# EAGLE design octanis_eps (EAGLE 7.1.0)
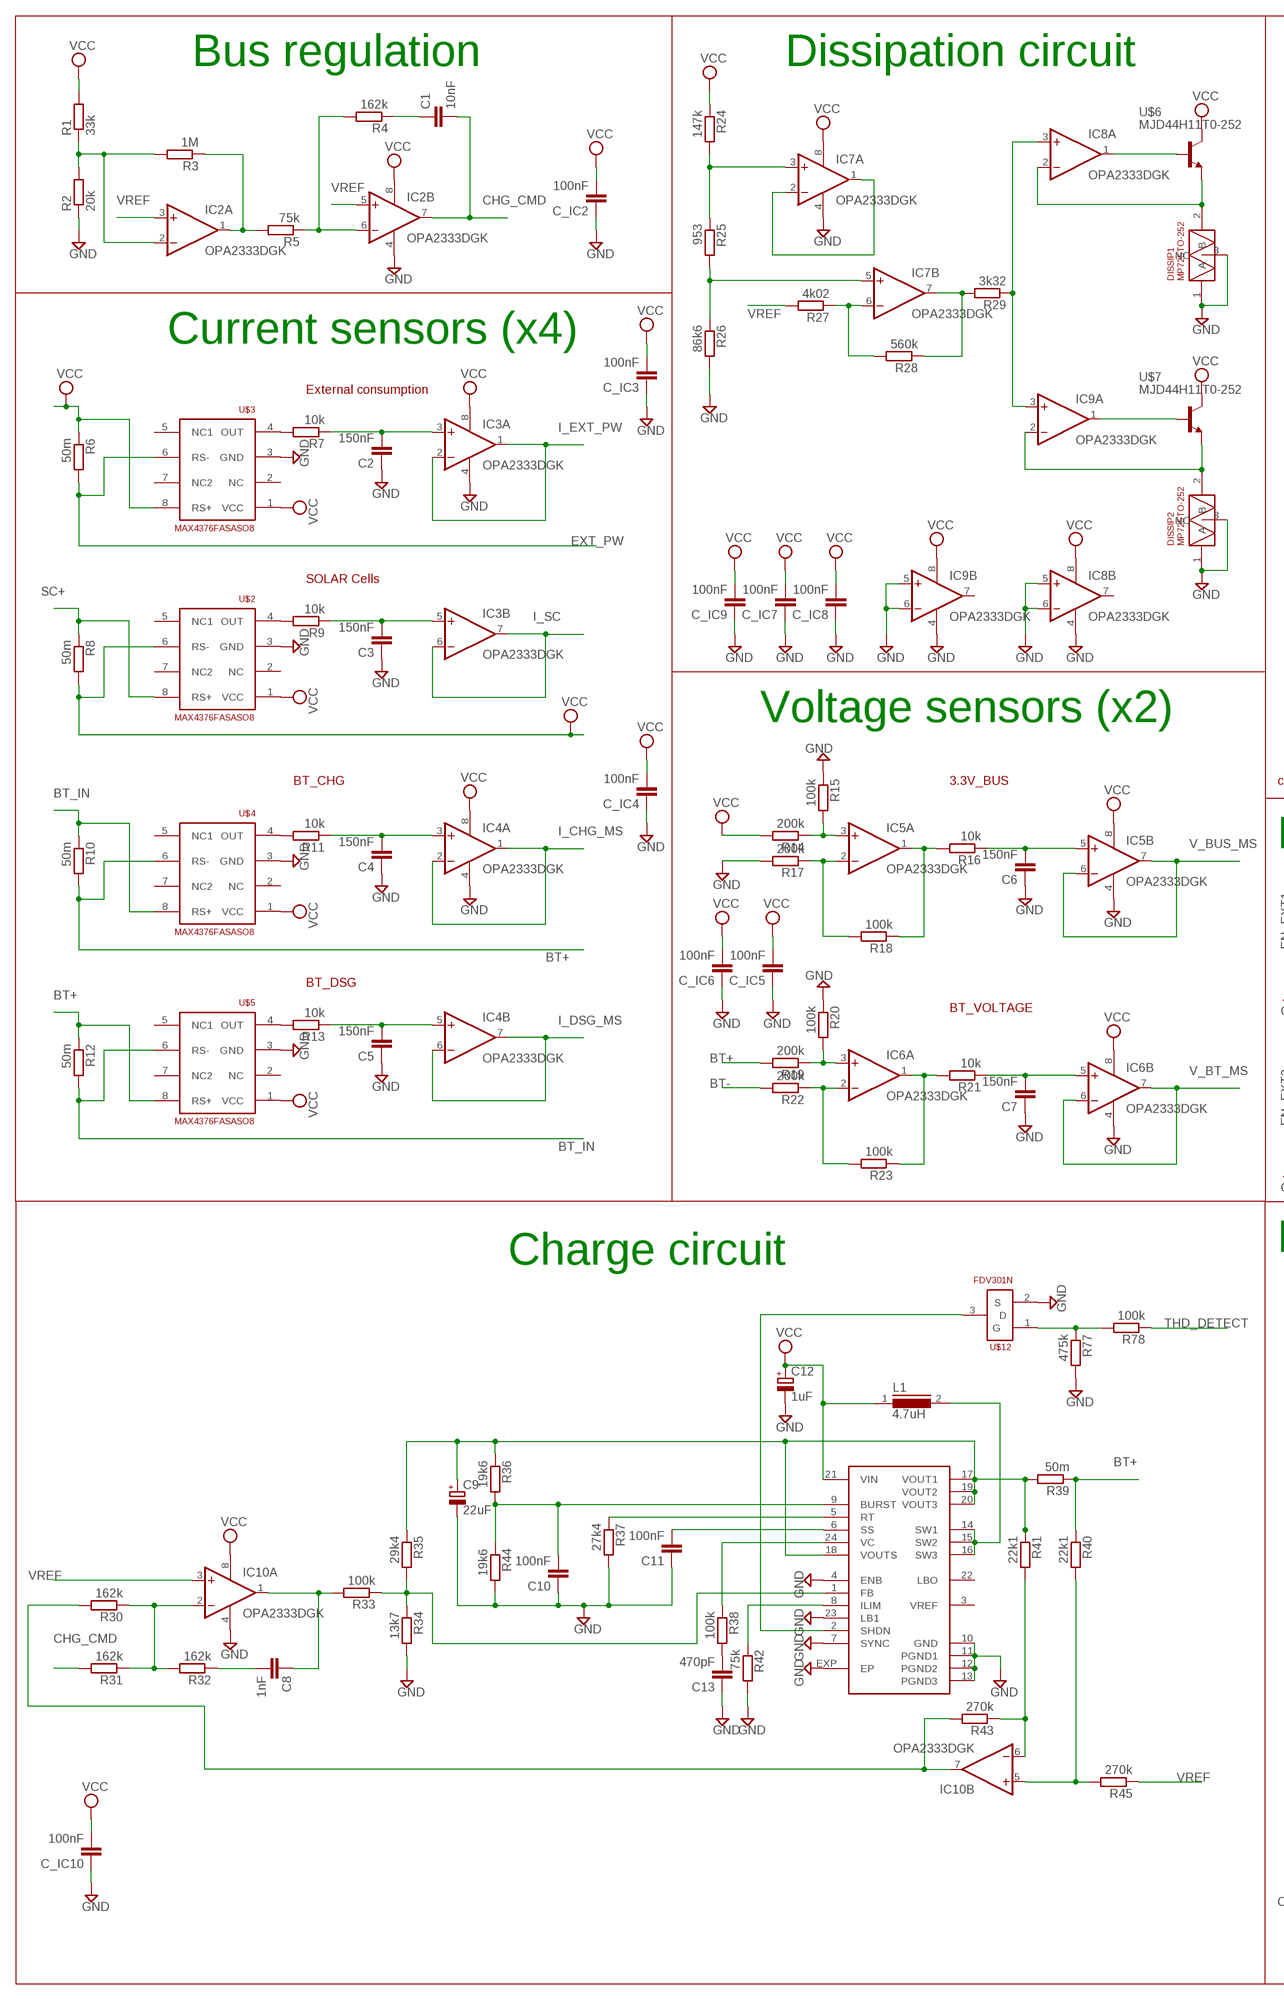
[diagram p0: schematic, sheet 1, part 1 of 2]
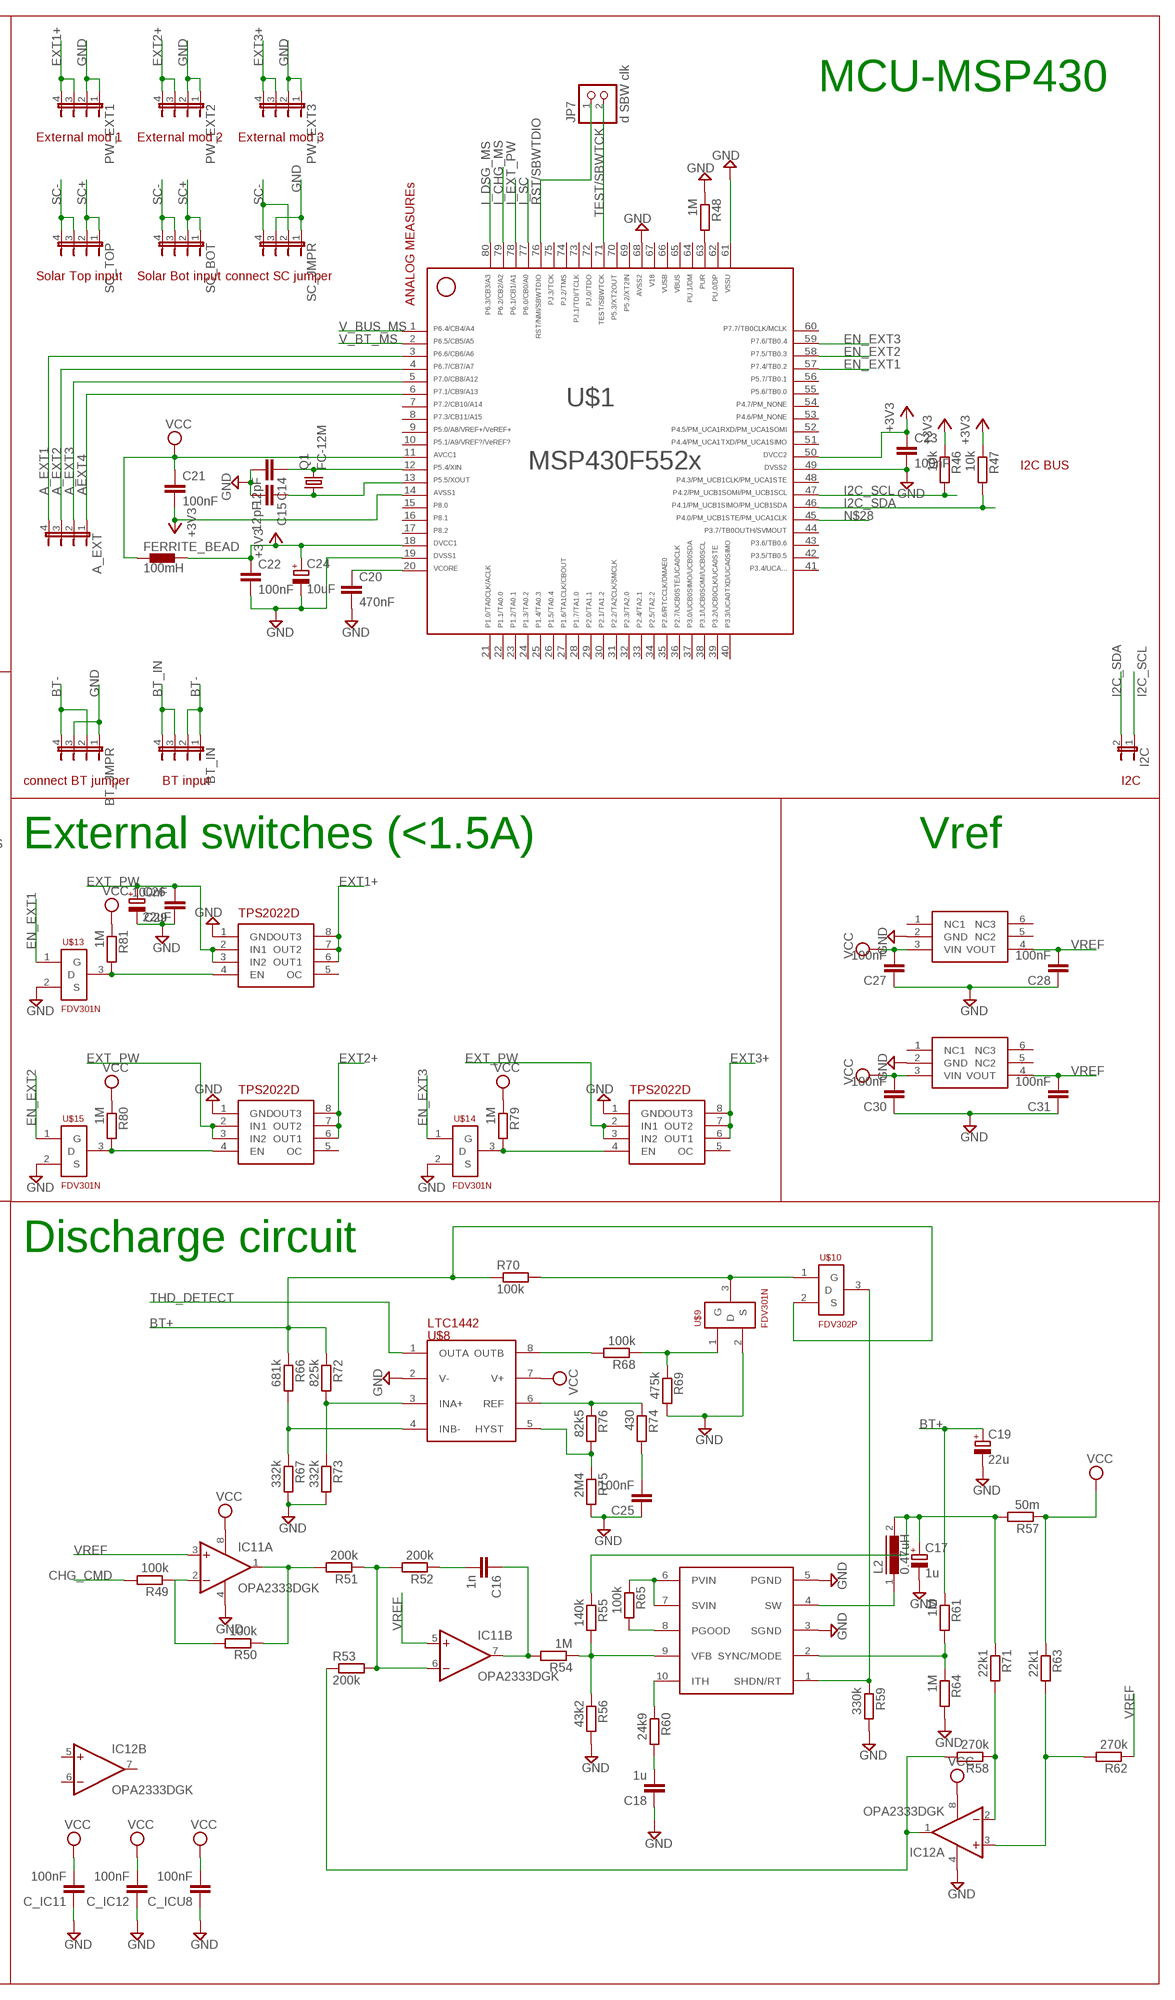
[diagram p1: schematic, sheet 1, part 2 of 2]

## Parts
A_EXT  JP4E  [JP4]
BT_IN  JP4E  [JP4]
BT_JMPR  JP4E  [JP4]
C1  10nF  C-EUC0603  [C0603]
C2  150nF  C-EUC0603  [C0603]
C3  150nF  C-EUC0603  [C0603]
C4  150nF  C-EUC0603  [C0603]
C5  150nF  C-EUC0603  [C0603]
C6  150nF  C-EUC0603  [C0603]
C7  150nF  C-EUC0603  [C0603]
C8  1nF  C-EUC0603  [C0603]
C9  22uF  CPOL-EUA/3216-18R  [A/3216-18R]
C10  100nF  C-EUC0603  [C0603]
C11  100nF  C-EUC0603  [C0603]
C12  1uF  CPOL-EUA/3216-18R  [A/3216-18R]
C13  470pF  C-EUC0603  [C0603]
C14  12pF  C-EUC0603  [C0603]
C15  12pF  C-EUC0603  [C0603]
C16  1n  C-EUC0603  [C0603]
C17  1u  CPOL-EUA/3216-18R  [A/3216-18R]
C18  1u  C-EUC0603  [C0603]
C19  22u  CPOL-EUA/3216-18R  [A/3216-18R]
C20  470nF  C-EUC0603  [C0603]
C21  100nF  C-EUC0603  [C0603]
C22  100nF  C-EUC0603  [C0603]
C23  100nF  C-EUC0603  [C0603]
C24  10uF  CPOL-EUA/3216-18R  [A/3216-18R]
C25  100nF  C-EUC0603  [C0603]
C26  22uF  CPOL-EUA/3216-18R  [A/3216-18R]
C27  100nF  C-EUC0603  [C0603]
C28  100nF  C-EUC0603  [C0603]
C29  100nF  C-EUC0603  [C0603]
C30  100nF  C-EUC0603  [C0603]
C31  100nF  C-EUC0603  [C0603]
C_IC2  100nF  C-EUC0603  [C0603]
C_IC3  100nF  C-EUC0603  [C0603]
C_IC4  100nF  C-EUC0603  [C0603]
C_IC5  100nF  C-EUC0603  [C0603]
C_IC6  100nF  C-EUC0603  [C0603]
C_IC7  100nF  C-EUC0603  [C0603]
C_IC8  100nF  C-EUC0603  [C0603]
C_IC9  100nF  C-EUC0603  [C0603]
C_IC10  100nF  C-EUC0603  [C0603]
C_IC11  100nF  C-EUC0603  [C0603]
C_IC12  100nF  C-EUC0603  [C0603]
C_ICU8  100nF  C-EUC0603  [C0603]
DISSIP1  MP725TO-252  [TO252]
DISSIP2  MP725TO-252  [TO252]
FERRITE_BEAD  100mH  BLM15HD601SN1  [0402]
I2C  JP1E  [JP1]
IC2  OPA2333DGK  [MSOP08]
IC3  OPA2333DGK  [MSOP08]
IC4  OPA2333DGK  [MSOP08]
IC5  OPA2333DGK  [MSOP08]
IC6  OPA2333DGK  [MSOP08]
IC7  OPA2333DGK  [MSOP08]
IC8  OPA2333DGK  [MSOP08]
IC9  OPA2333DGK  [MSOP08]
IC10  OPA2333DGK  [MSOP08]
IC11  OPA2333DGK  [MSOP08]
IC12  OPA2333DGK  [MSOP08]
JP7  d SBW clk  PINHD-1X2  [1X02]
L1  4.7uH  DR73  [DR73]
L2  0.47uH  DR73  [DR73]
LTC3411  LT3411  [MSOP10]
PW_EXT1  JP4E  [JP4]
PW_EXT2  JP4E  [JP4]
PW_EXT3  JP4E  [JP4]
Q1  FC-12M  [FC-12M]
R1  33k  R-EU_R0603  [R0603]
R2  20k  R-EU_R0603  [R0603]
R3  1M  R-EU_R0603  [R0603]
R4  162k  R-EU_R0603  [R0603]
R5  75k  R-EU_R0603  [R0603]
R6  50m  R-EU_R1206  [R1206]
R7  10k  R-EU_R0603  [R0603]
R8  50m  R-EU_R1206  [R1206]
R9  10k  R-EU_R0603  [R0603]
R10  50m  R-EU_R1206  [R1206]
R11  10k  R-EU_R0603  [R0603]
R12  50m  R-EU_R1206  [R1206]
R13  10k  R-EU_R0603  [R0603]
R14  200k  R-EU_R0603  [R0603]
R15  100k  R-EU_R0603  [R0603]
R16  10k  R-EU_R0603  [R0603]
R17  200k  R-EU_R0603  [R0603]
R18  100k  R-EU_R0603  [R0603]
R19  200k  R-EU_R0603  [R0603]
R20  100k  R-EU_R0603  [R0603]
R21  10k  R-EU_R0603  [R0603]
R22  200k  R-EU_R0603  [R0603]
R23  100k  R-EU_R0603  [R0603]
R24  147k  R-EU_R0603  [R0603]
R25  953  R-EU_R0603  [R0603]
R26  86k6  R-EU_R0603  [R0603]
R27  4k02  R-EU_R0603  [R0603]
R28  560k  R-EU_R0603  [R0603]
R29  3k32  R-EU_R0603  [R0603]
R30  162k  R-EU_R0603  [R0603]
R31  162k  R-EU_R0603  [R0603]
R32  162k  R-EU_R0603  [R0603]
R33  100k  R-EU_R0603  [R0603]
R34  13k7  R-EU_R0603  [R0603]
R35  29k4  R-EU_R0603  [R0603]
R36  19k6  R-EU_R0603  [R0603]
R37  27k4  R-EU_R0603  [R0603]
R38  100k  R-EU_R0603  [R0603]
R39  50m  R-EU_R1206  [R1206]
R40  22k1  R-EU_R0603  [R0603]
R41  22k1  R-EU_R0603  [R0603]
R42  75k  R-EU_R0603  [R0603]
R43  270k  R-EU_R0603  [R0603]
R44  19k6  R-EU_R0603  [R0603]
R45  270k  R-EU_R0603  [R0603]
R46  10k  R-EU_R0603  [R0603]
R47  10k  R-EU_R0603  [R0603]
R48  1M  R-EU_R0603  [R0603]
R49  100k  R-EU_R0603  [R0603]
R50  100k  R-EU_R0603  [R0603]
R51  200k  R-EU_R0603  [R0603]
R52  200k  R-EU_R0603  [R0603]
R53  200k  R-EU_R0603  [R0603]
R54  1M  R-EU_R0603  [R0603]
R55  140k  R-EU_R0603  [R0603]
R56  43k2  R-EU_R0603  [R0603]
R57  50m  R-EU_R1206  [R1206]
R58  270k  R-EU_R0603  [R0603]
R59  330k  R-EU_R0603  [R0603]
R60  24k9  R-EU_R0603  [R0603]
R61  1M  R-EU_R0603  [R0603]
R62  270k  R-EU_R0603  [R0603]
R63  22k1  R-EU_R0603  [R0603]
R64  1M  R-EU_R0603  [R0603]
R65  100k  R-EU_R0603  [R0603]
R66  681k  R-EU_R0603  [R0603]
R67  332k  R-EU_R0603  [R0603]
R68  100k  R-EU_R0603  [R0603]
R69  475k  R-EU_R0603  [R0603]
R70  100k  R-EU_R0603  [R0603]
R71  22k1  R-EU_R0603  [R0603]
R72  825k  R-EU_R0603  [R0603]
R73  332k  R-EU_R0603  [R0603]
R74  430  R-EU_R0603  [R0603]
R75  2M4  R-EU_R0603  [R0603]
R76  82k5  R-EU_R0603  [R0603]
R77  475k  R-EU_R0603  [R0603]
R78  100k  R-EU_R0603  [R0603]
R79  1M  R-EU_R0603  [R0603]
R80  1M  R-EU_R0603  [R0603]
R81  1M  R-EU_R0603  [R0603]
SC_BOT  JP4E  [JP4]
SC_JMPR  JP4E  [JP4]
SC_TOP  JP4E  [JP4]
U$1  F552X---PN80  [PN80]
U$2  MAX4376FASASO8  [SO8]
U$3  MAX4376FASASO8  [SO8]
U$4  MAX4376FASASO8  [SO8]
U$5  MAX4376FASASO8  [SO8]
U$6  MJD44H11T0-252  [TO252]
U$7  MJD44H11T0-252  [TO252]
U$8  LTC1442  [SO8]
U$9  FDV301N  [SOT23]
U$10  FDV302P  [SOT23]
U$11  LTC3421  [QFN24]
U$12  FDV301N  [SOT23]
U$13  FDV301N  [SOT23]
U$14  FDV301N  [SOT23]
U$15  FDV301N  [SOT23]
U$16  TPS2022D  [SO8]
U$17  TPS2022D  [SO8]
U$18  TPS2022D  [SO8]
U$19  ADR127B  [TSOT23-6]
U$20  ADR127B  [TSOT23-6]

## Nets
+3V3: C21.2 C22.1 C23.1 C24.+ FERRITE_BEAD.2 R46.1 R47.1 U$1.14 U$1.18 U$1.50
A_EXT1: A_EXT.4 U$1.3
A_EXT2: A_EXT.3 U$1.4
A_EXT3: A_EXT.2 U$1.5
AEXT4: A_EXT.1 U$1.6
BT+: C19.+ R10.2 R12.1 R19.2 R39.1 R40.1 R61.1 R66.1 R70.1 R72.1 U$4.6(RS-) U$5.8(RS+) U$10.2(S)
BT-: BT_IN.1 BT_IN.2 BT_JMPR.2 BT_JMPR.4 R22.2
BT_IN: BT_IN.3 BT_IN.4 R10.1 R12.2 U$4.8(RS+) U$5.6(RS-)
CHG_CMD: C1.2 IC2.7(B:OUT) R31.2 R49.2
EN_EXT1: U$1.57 U$13.1(G)
EN_EXT2: U$1.58 U$15.1(G)
EN_EXT3: U$1.59 U$14.1(G)
EXT1+: PW_EXT1.3 PW_EXT1.4 U$16.6(OUT1) U$16.7(OUT2) U$16.8(OUT3)
EXT2+: PW_EXT2.3 PW_EXT2.4 U$17.6(OUT1) U$17.7(OUT2) U$17.8(OUT3)
EXT3+: PW_EXT3.3 PW_EXT3.4 U$18.6(OUT1) U$18.7(OUT2) U$18.8(OUT3)
EXT_PW: C26.+ C29.2 R6.2 U$3.6(RS-) U$16.2(IN1) U$16.3(IN2) U$17.2(IN1) U$17.3(IN2) U$18.2(IN1) U$18.3(IN2)
GND: BT_JMPR.1 BT_JMPR.3 C2.1 C3.1 C4.1 C5.1 C6.1 C7.1 C9.- C10.1 C11.1 C12.- C13.1 C14.2 C15.2 C17.- C18.1 C19.- C20.2 C22.2 C23.2 C24.- C25.1 C26.- C27.1 C28.1 C29.1 C30.1 C31.1 C_IC2.1 C_IC3.1 C_IC4.1 C_IC5.1 C_IC6.1 C_IC7.1 C_IC8.1 C_IC9.1 C_IC10.1 C_IC11.1 C_IC12.1 C_ICU8.1 DISSIP1.1(A) DISSIP1.3(NC) DISSIP2.1(A) DISSIP2.3(NC) IC2.4(P:V-) IC3.4(P:V-) IC4.4(P:V-) IC5.4(P:V-) IC6.4(P:V-) IC7.4(P:V-) IC8.4(P:V-) IC8.5(B:+IN) IC8.6(B:-IN) IC9.4(P:V-) IC9.5(B:+IN) IC9.6(B:-IN) IC10.4(P:V-) IC11.4(P:V-) IC12.4(P:V-) LTC3411.3(SGND) LTC3411.5(PGND) PW_EXT1.1 PW_EXT1.2 PW_EXT2.1 PW_EXT2.2 PW_EXT3.1 PW_EXT3.2 R2.1 R15.1 R17.2 R20.1 R26.2 R34.2 R37.2 R42.2 R44.2 R48.1 R56.2 R59.2 R64.2 R67.2 R69.2 R73.2 R75.2 R77.2 SC_JMPR.1 SC_JMPR.3 U$1.19 U$1.49 U$1.61 U$1.68 U$2.3(GND) U$3.3(GND) U$4.3(GND) U$5.3(GND) U$8.2(V-) U$9.2(S) U$11.4(ENB) U$11.7(SYNC) U$11.10(GND) U$11.11(PGND1) U$11.12(PGND2) U$11.13(PGND3) U$11.23(LB1) U$11.EXP(EP) U$12.2(S) U$13.2(S) U$14.2(S) U$15.2(S) U$16.1(GND) U$17.1(GND) U$18.1(GND) U$19.2(GND) U$20.2(GND)
I2C_SCL: I2C.1 R46.2 U$1.47
I2C_SDA: I2C.2 R47.2 U$1.46
I_CHG_MS: IC4.1(A:OUT) IC4.2(A:-IN) U$1.79
I_DSG_MS: IC4.6(B:-IN) IC4.7(B:OUT) U$1.80
I_EXT_PW: IC3.1(A:OUT) IC3.2(A:-IN) U$1.78
I_SC: IC3.6(B:-IN) IC3.7(B:OUT) U$1.77
N$1: IC2.2(A:-IN) R1.1 R2.2 R3.2
N$2: IC2.1(A:OUT) R3.1 R5.2
N$3: C1.1 R4.1
N$4: IC2.6(B:-IN) R4.2 R5.1
N$5: C4.2 IC4.3(A:+IN) R11.1
N$6: C2.2 IC3.3(A:+IN) R7.1
N$7: C3.2 IC3.5(B:+IN) R9.1
N$8: C5.2 IC4.5(B:+IN) R13.1
N$9: C7.2 IC6.5(B:+IN) R21.1
N$10: IC6.1(A:OUT) R21.2 R23.1
N$11: C6.2 IC5.5(B:+IN) R16.1
N$12: IC5.1(A:OUT) R16.2 R18.1
N$13: IC5.2(A:-IN) R17.1 R18.2
N$14: IC5.3(A:+IN) R14.1 R15.2
N$15: IC6.2(A:-IN) R22.1 R23.2
N$16: IC6.3(A:+IN) R19.1 R20.2
N$17: IC7.1(A:OUT) IC7.2(A:-IN)
N$18: IC7.3(A:+IN) R24.2 R25.1
N$19: IC7.5(B:+IN) R25.2 R26.1
N$20: IC7.6(B:-IN) R27.1 R28.2
N$21: IC7.7(B:OUT) R28.1 R29.2
N$22: IC8.3(A:+IN) IC9.3(A:+IN) R29.1
N$23: IC10.2(A:-IN) R30.1 R31.1 R32.2
N$24: C8.2 R32.1
N$25: C8.1 IC10.1(A:OUT) R33.2
N$26: R33.1 R34.1 R35.2 U$11.1(FB)
N$27: R48.2 U$1.63
N$28: U$1.45
N$29: R42.1 U$11.8(ILIM)
N$30: C10.2 R36.2 R44.1 U$11.9(BURST)
N$31: C13.2 R38.2
N$32: R37.1 U$11.5(RT)
N$33: C11.2 U$11.6(SS)
N$34: R80.2 U$15.3(D) U$17.4(EN)
N$35: C18.2 R60.2
N$36: R38.1 U$11.24(VC)
N$37: U$11.2(SHDN) U$12.3(D)
N$38: IC10.5(B:+IN) R40.2 R45.2
N$39: IC10.6(B:-IN) R41.2 R43.1
N$40: R9.2 U$2.4(OUT)
N$41: R11.2 U$4.4(OUT)
N$42: R7.2 U$3.4(OUT)
N$43: R13.2 U$5.4(OUT)
N$44: IC8.1(A:OUT) U$6.1(B)
N$45: IC9.1(A:OUT) U$7.1(B)
N$46: DISSIP2.2(B) IC9.2(A:-IN) U$7.3(E)
N$47: DISSIP1.2(B) IC8.2(A:-IN) U$6.3(E)
N$48: C14.1 Q1.2 U$1.12
N$49: C20.1 U$1.20
N$50: C15.1 Q1.1 U$1.13
N$51: C16.1 IC11.7(B:OUT) R54.2
N$52: IC11.2(A:-IN) R49.1 R50.2
N$53: IC11.1(A:OUT) R50.1 R51.2
N$54: IC11.6(B:-IN) R51.1 R52.2 R53.2
N$55: C16.2 R52.1
N$56: IC12.1(A:OUT) R53.1 R58.2
N$57: LTC3411.9(VFB) R54.1 R55.2 R56.1
N$58: C17.+ L2.2 R55.1 R57.2 R71.1
N$59: LTC3411.10(ITH) R60.1
N$60: LTC3411.2(SYNC/MODE) R61.2 R64.1
N$61: IC12.2(A:-IN) R58.1 R71.2
N$63: IC12.3(A:+IN) R62.2 R63.2
N$64: LTC3411.8(PGOOD) R65.2
N$65: LTC3411.6(PVIN) LTC3411.7(SVIN) R65.1
N$66: LTC3411.1(SHDN/RT) R59.1 U$10.3(D)
N$67: R66.2 R67.1 U$8.4(INB-)
N$68: R68.2 U$8.8(OUTB)
N$69: R68.1 R69.1 U$9.1(G)
N$70: R72.2 R73.1 U$8.3(INA+)
N$71: R70.2 U$9.3(D) U$10.1(G)
N$72: R74.1 R76.1 U$8.6(REF)
N$73: R75.1 R76.2 U$8.5(HYST)
N$74: C25.2 R74.2
N$75: C9.+ R35.1 R36.1 R39.2 R41.1 U$11.17(VOUT1) U$11.18(VOUTS) U$11.19(VOUT2) U$11.20(VOUT3)
N$76: R77.1 R78.2 U$12.1(G)
N$77: L2.1 LTC3411.4(SW)
N$78: L1.2 U$11.14(SW1) U$11.15(SW2) U$11.16(SW3)
N$79: R81.2 U$13.3(D) U$16.4(EN)
N$80: R79.2 U$14.3(D) U$18.4(EN)
RST/SBWTDIO: JP7.1 U$1.76
SC+: R8.1 SC_BOT.1 SC_BOT.2 SC_TOP.1 SC_TOP.2 U$2.8(RS+)
SC-: SC_BOT.3 SC_BOT.4 SC_JMPR.2 SC_JMPR.4 SC_TOP.3 SC_TOP.4
TEST/SBWTCK: JP7.2 U$1.71
THD_DETECT: R78.1 U$8.1(OUTA)
UUU: IC10.7(B:OUT) R30.2 R43.2
V_BT_MS: IC6.6(B:-IN) IC6.7(B:OUT) U$1.2
V_BUS_MS: IC5.6(B:-IN) IC5.7(B:OUT) U$1.1
VCC: C12.+ C21.1 C27.2 C30.2 C_IC2.2 C_IC3.2 C_IC4.2 C_IC5.2 C_IC6.2 C_IC7.2 C_IC8.2 C_IC9.2 C_IC10.2 C_IC11.2 C_IC12.2 C_ICU8.2 FERRITE_BEAD.1 IC2.8(P:V+) IC3.8(P:V+) IC4.8(P:V+) IC5.8(P:V+) IC6.8(P:V+) IC7.8(P:V+) IC8.8(P:V+) IC9.8(P:V+) IC10.8(P:V+) IC11.8(P:V+) IC12.8(P:V+) L1.1 R1.2 R6.1 R8.2 R14.2 R24.1 R57.1 R63.1 R79.1 R80.1 R81.1 U$1.11 U$2.1(VCC) U$2.6(RS-) U$3.1(VCC) U$3.8(RS+) U$4.1(VCC) U$5.1(VCC) U$6.2(C) U$7.2(C) U$8.7(V+) U$11.21(VIN) U$19.3(VIN) U$20.3(VIN)
VREF: C28.2 C31.2 IC2.3(A:+IN) IC2.5(B:+IN) IC10.3(A:+IN) IC11.3(A:+IN) IC11.5(B:+IN) R27.2 R45.1 R62.1 U$19.4(VOUT) U$20.4(VOUT)
Unconnected: IC8.7(B:OUT) IC9.7(B:OUT) IC12.5(B:+IN) IC12.6(B:-IN) IC12.7(B:OUT) U$1.7 U$1.8 U$1.9 U$1.10 U$1.15 U$1.16 U$1.17 U$1.21 U$1.22 U$1.23 U$1.24 U$1.25 U$1.26 U$1.27 U$1.28 U$1.29 U$1.30 U$1.31 U$1.32 U$1.33 U$1.34 U$1.35 U$1.36 U$1.37 U$1.38 U$1.39 U$1.40 U$1.41 U$1.42 U$1.43 U$1.44 U$1.48 U$1.51 U$1.52 U$1.53 U$1.54 U$1.55 U$1.56 U$1.60 U$1.62 U$1.64 U$1.69 U$1.70 U$1.72 U$1.73 U$1.74 U$1.75 U$2.2(NC) U$2.5(NC1) U$2.7(NC2) U$3.2(NC) U$3.5(NC1) U$3.7(NC2) U$4.2(NC) U$4.5(NC1) U$4.7(NC2) U$5.2(NC) U$5.5(NC1) U$5.7(NC2) U$11.3(VREF) U$11.22(LBO) U$16.5(OC) U$17.5(OC) U$18.5(OC) U$19.1(NC1) U$19.5(NC2) U$19.6(NC3) U$20.1(NC1) U$20.5(NC2) U$20.6(NC3)

## Notes on the sheet
- Bus regulation | Dissipation circuit
- MCU-MSP430
- External mod 1 | External mod 2 | External mod 3
- Solar Top input | Solar Bot input | connect SC jumper
- ANALOG MEASUREs
- Current sensors (x4)
- External consumption
- I2C BUS
- SOLAR Cells
- Voltage sensors (x2)
- BT_CHG | 3.3V_BUS | connect BT jumper | BT input | I2C
- External switches (<1.5A) | Vref
- BT_DSG
- BT_VOLTAGE
- Charge circuit | Discharge circuit

## Power pins joined to a net without a drawn wire
65: U$1.65
66: U$1.66
67: U$1.67

## Library data of the parts
A_EXT BT_IN BT_JMPR PW_EXT1-PW_EXT3 SC_BOT SC_JMPR SC_TOP = jumper:JP4E: JUMPER
C1-C8 C10 C11 C13-C16 C18 C20-C23 C25 C27-C31 C_IC2-C_IC12 C_ICU8 = rcl:C-EU: CAPACITOR, European symbol
C9 C12 C17 C19 C24 C26 = rcl:CPOL-EU: POLARIZED CAPACITOR, European symbol
DISSIP1 DISSIP2 = Octanis1_EPS:MP725
FERRITE_BEAD = inductors:BLM15H: EMIFIL (R) Chip Ferrite Bead for GHz Noise Source: http://www.murata.com/ Ferrite Bead BLM15H.pdf
I2C = jumper:JP1E: JUMPER
IC2-IC12 = linear:OPA2333: DUAL 1.8V, microPOWER CMOS OPERATIONAL AMPLIFIERS Zerø-Drift Series Source: Texas Instruments (Burr-Brown) .. U11 opa333 Operational Amp.pdf
JP7 = pinhead:PINHD-1X2: PIN HEADER
L1 L2 = inductors:DR73: High Power Density, High Efficiency, Shielded Inductors Source: coiltronics_dr_series.pdf
LTC3411 = Octanis1_EPS:LT3411: LINEAR TECHNOLOGY - LTC3411AEMS#PBF - CONV. BUCK SYNCH 1.25A 4MHZ 10MSOP
Q1 = crystal:FC-12M: kHz RANGE CRYSTAL UNIT LOW PROFILE SMD Source: Epson Toyocom FC-12M.pdf
R1-R81 = rcl:R-EU_: RESISTOR, European symbol
U$1 = TI_MSP430_v16:F552X---PN80: ***MSP430F552X***PN80 http://www.ti.com/lit/gpn/msp430f5529 Rev1.0 06/2010 For F552X where X is 1,5,7,9
U$2-U$5 = Octanis1_EPS:MAX4376FASA: MAX4376/MAX4377/ MAX4378 Single/Dual/Quad, High-Side Current-Sense Amplifiers with Internal Gain
U$6 U$7 = Octanis1_EPS:MJD44H11: MJD44H11, MJD45H11 Complementary power transistors
U$8 = Octanis1_EPS:LTC1442: Ultralow Power Single/Dual Comparator with Reference
U$9 U$12-U$15 = Octanis1_EPS:FDV301N: FDV301N Digital FET ,N-Channel
U$10 = Octanis1_EPS:FDV302P: FAIRCHILD SEMICONDUCTOR - FDV302P - TRANSISTOR MOSFET NUMERIQ P SOT-23
U$11 = Octanis1_EPS:LTC3421: 3A, 3MHz Micropower Synchronous Boost Converter with Output Disconnect
U$16-U$18 = Octanis1_EPS:TPS2022D: TEXAS INSTRUMENTS - TPS2022D - IC, 1.5A PWR DIST SWITCH 8SOIC
U$19 U$20 = Octanis1_EPS:ADR127B: ANALOG DEVICES - ADR127BUJZ-REEL7 - VOLTAGE REFERENCE, SERIES, 3.3V, TSOT-6

## Board
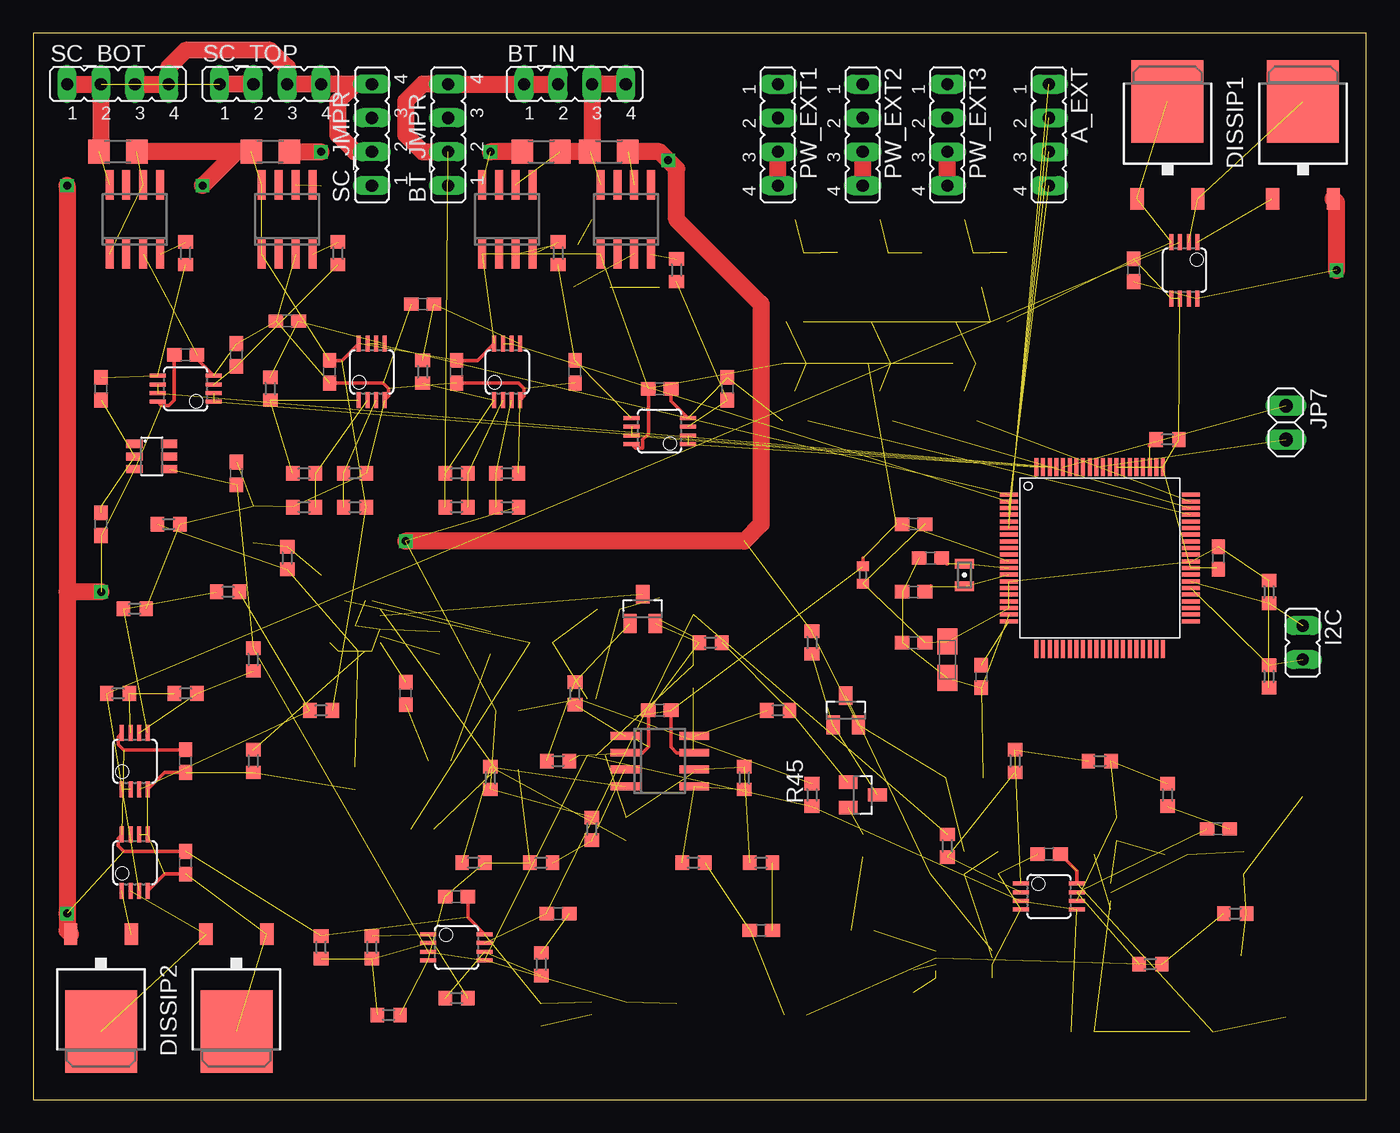
[diagram p2: board, top side]
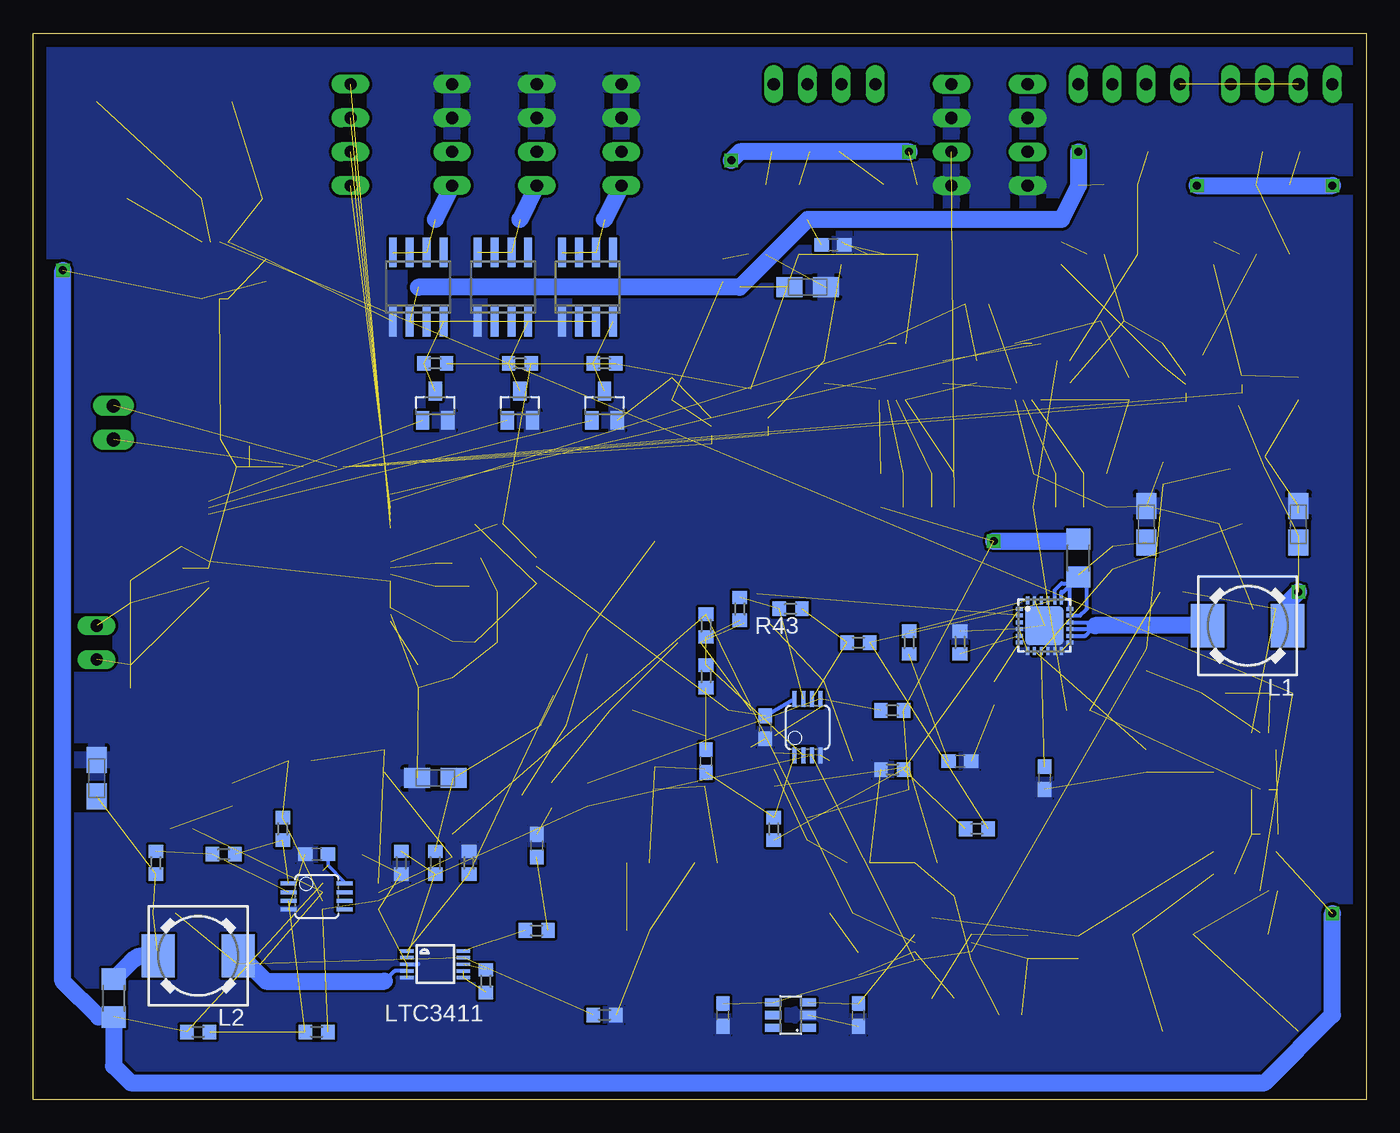
[diagram p3: board, bottom side, seen from below]

Size 100 x 80 mm. Coordinates in mm from the lower left corner, seen from the top.
Outline: 0,0 100,0 100,80 0,80 0,0
Copper layers (1*16): Top 0.035mm / dielectric 1.5mm / Bottom 0.035mm
Design rules "default": minimum track width 10mil, minimum drill 24mil, track to track 8mil, track to pad 8mil, pad to pad 8mil, via to via 8mil, smd to smd 8mil, copper to edge 40mil, drill to drill 8mil, minimum pad ring 10mil, minimum via ring 8mil, stop-mask expansion 4mil, vias tented up to drill 0mil, thermal gap 10mil

### Footprints (pad centres in the part's own frame; a part is rotated, then mirrored left to right if it is on the bottom)
JP4 = drill 0.914 long: 1 -3.81,0; 2 -1.27,0; 3 1.27,0; 4 3.81,0
C0603 = smd 1.1 x 1: 1 -0.85,0; 2 0.85,0
A/3216-18R = smd 1.95 x 1.5: + 1.375,0; - -1.375,0
TO252 = smd 1 x 1.6: 1 -2.28,-4.8; 2 2.28,-4.8 | smd 5.4 x 6.2: 3 0,2.5
0402 = smd 0.7 x 0.9: 1 -0.65,0; 2 0.65,0
JP1 = drill 0.914 long: 1 0,-1.27; 2 0,1.27
MSOP08 = smd 0.3 x 1.2: 1 -0.976,-2.113; 2 -0.326,-2.113; 3 0.324,-2.113; 4 0.974,-2.113; 5 0.974,2.112; 6 0.324,2.112; 7 -0.326,2.112; 8 -0.976,2.112
1X02 = drill 1.016 long: 1 -1.27,0; 2 1.27,0
DR73 = smd 2.5 x 3.25: 1 -3,0; 2 3,0
MSOP10 = smd 0.25 x 1: 1 -1,-2.113; 2 -0.5,-2.113; 3 0,-2.113; 4 0.5,-2.113; 5 1,-2.113; 6 1,2.113; 7 0.5,2.113; 8 0,2.113; 9 -0.5,2.113; 10 -1,2.113
FC-12M = smd 0.7 x 1.4: 1 -0.85,0; 2 0.85,0
R0603 = smd 1 x 1.1: 1 -0.85,0; 2 0.85,0
R1206 = smd 1.6 x 1.803: 1 -1.422,0; 2 1.422,0
PN80 = smd 1.35 x 0.3: 1 -6.825,4.75; 2 -6.825,4.25; 3 -6.825,3.75; 4 -6.825,3.25; 5 -6.825,2.75; 6 -6.825,2.25; 7 -6.825,1.75; 8 -6.825,1.25; 9 -6.825,0.75; 10 -6.825,0.25; 11 -6.825,-0.25; 12 -6.825,-0.75; 13 -6.825,-1.25; 14 -6.825,-1.75; 15 -6.825,-2.25; 16 -6.825,-2.75; 17 -6.825,-3.25; 18 -6.825,-3.75; 19 -6.825,-4.25; 20 -6.825,-4.75; 41 6.825,-4.75; 42 6.825,-4.25; 43 6.825,-3.75; 44 6.825,-3.25; 45 6.825,-2.75; 46 6.825,-2.25; 47 6.825,-1.75; 48 6.825,-1.25; 49 6.825,-0.75; 50 6.825,-0.25; 51 6.825,0.25; 52 6.825,0.75; 53 6.825,1.25; 54 6.825,1.75; 55 6.825,2.25; 56 6.825,2.75; 57 6.825,3.25; 58 6.825,3.75; 59 6.825,4.25; 60 6.825,4.75 | smd 0.3 x 1.35: 21 -4.75,-6.825; 22 -4.25,-6.825; 23 -3.75,-6.825; 24 -3.25,-6.825; 25 -2.75,-6.825; 26 -2.25,-6.825; 27 -1.75,-6.825; 28 -1.25,-6.825; 29 -0.75,-6.825; 30 -0.25,-6.825; 31 0.25,-6.825; 32 0.75,-6.825; 33 1.25,-6.825; 34 1.75,-6.825; 35 2.25,-6.825; 36 2.75,-6.825; 37 3.25,-6.825; 38 3.75,-6.825; 39 4.25,-6.825; 40 4.75,-6.825; 61 4.75,6.825; 62 4.25,6.825; 63 3.75,6.825; 64 3.25,6.825; 65 2.75,6.825; 66 2.25,6.825; 67 1.75,6.825; 68 1.25,6.825; 69 0.75,6.825; 70 0.25,6.825; 71 -0.25,6.825; 72 -0.75,6.825; 73 -1.25,6.825; 74 -1.75,6.825; 75 -2.25,6.825; 76 -2.75,6.825; 77 -3.25,6.825; 78 -3.75,6.825; 79 -4.25,6.825; 80 -4.75,6.825
SO8 = smd 0.6 x 2.2: 1 -1.905,-2.6; 2 -0.635,-2.6; 3 0.635,-2.6; 4 1.905,-2.6; 5 1.905,2.6; 6 0.635,2.6; 7 -0.635,2.6; 8 -1.905,2.6
SOT23 = smd 1 x 1.4: 1 -0.95,-1.1; 2 0.95,-1.1; 3 0,1.1
QFN24 = smd 0.6 x 0.3: 1 -1.905,1.27; 2 -1.905,0.762; 3 -1.905,0.254; 4 -1.905,-0.254; 5 -1.905,-0.762; 6 -1.905,-1.27; 13 1.905,-1.27; 14 1.905,-0.762; 15 1.905,-0.254; 16 1.905,0.254; 17 1.905,0.762; 18 1.905,1.27 | smd 0.3 x 0.6: 7 -1.27,-1.905; 8 -0.762,-1.905; 9 -0.254,-1.905; 10 0.254,-1.905; 11 0.762,-1.905; 12 1.27,-1.905; 19 1.27,1.905; 20 0.762,1.905; 21 0.254,1.905; 22 -0.254,1.905; 23 -0.762,1.905; 24 -1.27,1.905 | smd 2.9 x 2.9: EXP 0,0
TSOT23-6 = smd 0.62 x 1.22: 1 -0.95,-1.3; 2 0,-1.3; 3 0.95,-1.3; 4 0.95,1.3; 5 0,1.3; 6 -0.95,1.3

### Placement (x,y rotation side)
A_EXT  76.2,72.39 270 top
BT_IN  40.64,76.2 0 top
BT_JMPR  31.11,72.39 90 top
C1  39.37,13.97 180 top
C2  15.24,55.88 270 top
C3  5.08,53.34 90 top
C4  52.07,53.34 270 top
C5  40.64,54.61 90 top
C6  19.05,58.42 0 top
C7  29.21,59.69 0 top
C8  49.53,25.4 90 bottom
C9  16.51,43.18 270 bottom
C10  24.13,24.13 90 bottom
C11  27.94,30.48 90 top
C12  5.08,43.18 270 bottom
C13  30.48,25.4 180 bottom
C14  67.31,40.64 180 top
C15  66.04,38.1 180 top
C16  88.9,20.32 0 top
C17  95.25,24.13 270 bottom
C18  62.23,19.05 270 bottom
C19  69.85,24.13 0 bottom
C20  71.12,31.75 270 top
C21  66.04,43.18 0 top
C22  66.04,34.29 180 top
C23  88.9,40.64 270 top
C24  68.58,33.02 90 top
C25  54.61,12.7 0 top
C26  41.91,60.96 180 bottom
C27  5.08,43.18 270 top
C28  15.24,46.99 270 top
C29  40.01,64.14 180 bottom
C30  38.1,6.35 90 bottom
C31  48.26,6.35 90 bottom
C_IC2  31.75,15.24 0 top
C_IC3  11.43,55.88 180 top
C_IC4  46.99,53.34 180 top
C_IC5  22.23,54.61 90 top
C_IC6  31.75,54.61 90 top
C_IC7  11.43,25.4 90 top
C_IC8  82.55,62.23 270 top
C_IC9  11.43,17.78 90 top
C_IC10  45.09,27.94 90 bottom
C_IC11  76.2,18.41 0 top
C_IC12  78.74,18.41 0 bottom
C_ICU8  46.99,29.21 0 top
DISSIP1  85.09,72.39 0 top
DISSIP2  15.24,7.62 180 top
FERRITE_BEAD  62.23,39.37 270 top
I2C  95.25,34.29 180 top
IC2  31.75,11.43 270 top
IC3  11.43,53.34 90 top
IC4  46.99,50.16 90 top
IC5  25.4,54.61 0 top
IC6  35.56,54.61 0 top
IC7  7.62,25.4 0 top
IC8  86.36,62.23 180 top
IC9  7.62,17.78 0 top
IC10  41.91,27.94 0 bottom
IC11  76.2,15.24 270 top
IC12  78.74,15.24 270 bottom
JP7  93.98,50.8 270 top
L1  8.89,35.56 180 bottom
L2  87.63,10.79 180 bottom
LTC3411  69.85,10.16 270 bottom
PW_EXT1  55.88,72.39 270 top
PW_EXT2  62.23,72.39 270 top
PW_EXT3  68.58,72.39 270 top
Q1  69.85,39.37 90 top
R1  21.59,11.43 90 top
R2  26.67,6.35 180 top
R3  25.4,11.43 270 top
R4  38.1,10.16 270 top
R5  31.75,7.62 0 top
R6  17.78,71.12 0 top
R7  22.86,63.5 90 top
R8  6.35,71.12 0 top
R9  11.43,63.5 90 top
R10  38.1,71.12 180 top
R11  48.26,62.23 90 top
R12  43.18,71.12 180 top
R13  39.37,63.5 90 top
R14  24.13,44.45 0 top
R15  24.13,46.99 180 top
R16  17.78,53.34 270 top
R17  20.32,44.45 180 top
R18  20.32,46.99 0 top
R19  35.56,44.45 0 top
R20  35.56,46.99 180 top
R21  29.21,54.61 270 top
R22  31.75,44.45 180 top
R23  31.75,46.99 0 top
R24  21.59,29.21 180 top
R25  14.61,38.1 180 top
R26  7.62,36.83 0 top
R27  16.51,33.02 90 top
R28  11.43,30.48 0 top
R29  6.35,30.48 0 top
R30  46.99,36.83 90 bottom
R31  49.53,35.56 90 bottom
R32  49.53,31.75 90 bottom
R33  44.45,20.32 90 bottom
R34  35.56,24.77 180 bottom
R35  29.21,20.32 180 bottom
R36  19.05,40.64 270 top
R37  30.48,34.29 90 bottom
R38  34.29,34.29 270 bottom
R39  21.59,40.64 270 bottom
R40  35.56,29.21 180 bottom
R41  38.1,34.29 180 bottom
R42  16.51,25.4 270 top
R43  43.18,36.83 180 bottom
R44  10.16,43.18 0 top
R45  58.42,22.86 90 top
R46  92.71,38.1 270 top
R47  92.71,31.75 90 top
R48  85.09,49.53 180 top
R49  68.58,19.05 90 top
R50  73.66,25.4 270 top
R51  80.01,25.4 180 top
R52  85.09,22.86 90 top
R53  81.28,20.32 90 bottom
R54  83.82,10.16 180 top
R55  90.17,13.97 180 top
R56  57.15,6.35 0 bottom
R57  93.98,7.62 90 bottom
R58  85.72,18.41 0 bottom
R59  67.31,17.78 90 bottom
R60  62.23,12.7 0 bottom
R61  69.85,17.78 270 bottom
R62  78.74,5.08 180 bottom
R63  87.63,5.08 0 bottom
R64  72.39,17.78 270 bottom
R65  66.04,8.89 90 bottom
R66  34.29,24.13 90 top
R67  33.02,17.78 0 top
R68  55.88,29.21 180 top
R69  50.8,34.29 180 top
R70  58.42,34.29 270 top
R71  90.81,17.78 90 bottom
R72  41.91,20.32 270 top
R73  38.1,17.78 180 top
R74  54.61,17.78 0 top
R75  49.53,17.78 0 top
R76  53.34,24.13 270 top
R77  39.37,25.4 0 top
R78  40.64,30.48 90 top
R79  69.85,55.24 180 bottom
R80  63.5,55.24 180 bottom
R81  57.15,55.24 180 bottom
SC_BOT  6.35,76.2 0 top
SC_JMPR  25.4,72.39 90 top
SC_TOP  17.78,76.2 0 top
U$1  80.01,40.64 0 top
U$2  7.62,66.04 0 top
U$3  19.05,66.04 0 top
U$4  44.45,66.04 0 top
U$5  35.56,66.04 0 top
U$6  95.25,72.39 0 top
U$7  5.08,7.62 180 top
U$8  46.99,25.4 270 top
U$9  62.23,22.86 270 top
U$10  60.96,29.21 0 top
U$11  24.13,35.56 0 bottom
U$12  45.72,36.83 0 top
U$13  57.15,52.07 0 bottom
U$14  69.85,52.07 0 bottom
U$15  63.5,52.07 0 bottom
U$16  58.42,60.96 0 bottom
U$17  64.77,60.96 0 bottom
U$18  71.12,60.96 0 bottom
U$19  8.89,48.26 270 top
U$20  43.18,6.35 90 bottom

### Tracks (layer width: path | path; a pad name or v marks a point on that pad's centre or on a via)
+3V3  (9 unrouted)
A_EXT1  (1 unrouted)
A_EXT2  (1 unrouted)
A_EXT3  (1 unrouted)
AEXT4  (1 unrouted)
BT+  (via drill 0.6)  (10 unrouted)
  Top 1.27: R12.1 46.99,71.12 v47.62,70.48 48.26,69.85 48.26,66.04 54.54,59.76 arc-45 54.61,59.59 54.61,43.18 53.34,41.91 v27.94,41.91 | R10.2 v34.29,71.12
  Bottom 1.27: v27.94,41.91 21.74,41.91 R39.1 | v34.29,71.12 46.99,71.12 v47.62,70.48
BT-  (1 unrouted)
  Top 1.27: BT_IN.2 BT_IN.1 BT_JMPR.4 29.21,76.2 27.94,74.93 27.94,72.39 29.21,71.12 BT_JMPR.2
BT_IN  (2 unrouted)
  Top 1.27: BT_IN.4 BT_IN.3 41.91,71.54 R12.2 R10.1
CHG_CMD  (3 unrouted)
EN_EXT1  (1 unrouted)
EN_EXT2  (1 unrouted)
EN_EXT3  (1 unrouted)
EXT1+  (3 unrouted)
  Top 1.27: PW_EXT1.4 PW_EXT1.3
  Bottom 1.27: PW_EXT1.4 57.15,66.04
EXT2+  (3 unrouted)
  Top 1.27: PW_EXT2.4 PW_EXT2.3
  Bottom 1.27: PW_EXT2.4 63.5,66.04
EXT3+  (3 unrouted)
  Top 1.27: PW_EXT3.4 PW_EXT3.3
  Bottom 1.27: PW_EXT3.4 69.85,66.04
EXT_PW  (via drill 0.6)  (9 unrouted)
  Top 1.27: R6.2 v21.59,71.12
  Bottom 1.27: v21.59,71.12 21.59,68.58 22.86,66.04 41.91,66.04 46.99,60.96 71.12,60.96
GND  (74 unrouted)
  Top 0.254: C_ICU8.1 46.14,26.45 45.72,26.04 U$8.2 | C_IC5.1 26.25,53.76 26.67,53.34 26.67,52.79 IC5.4 | C_IC6.1 36.41,53.76 36.83,53.34 36.83,52.79 IC6.4 | C_IC3.1 12.28,55.58 IC3.4 | C_IC4.1 47.84,52.4 IC4.4 | C_IC7.1 9.86,24.55 IC7.4 | C_IC9.1 9.86,16.93 IC9.4
  Top 0.305: 88.8,39.89 C23.2
  Bottom 0.305: LTC3411.3 71.12,10.16
  pour Bottom: 0,80.01 100.33,80.01 100.33,0 0,0 0,78.74
I2C_SCL  (2 unrouted)
I2C_SDA  (2 unrouted)
I_CHG_MS  (2 unrouted)
I_DSG_MS  (2 unrouted)
I_EXT_PW  (2 unrouted)
I_SC  (2 unrouted)
N$1  (3 unrouted)
N$2  (2 unrouted)
N$3  (1 unrouted)
N$4  (2 unrouted)
N$5  (2 unrouted)
N$6  (2 unrouted)
N$7  (2 unrouted)
N$8  (2 unrouted)
N$9  (2 unrouted)
N$10  (2 unrouted)
N$11  (2 unrouted)
N$12  (2 unrouted)
N$13  (2 unrouted)
N$14  (2 unrouted)
N$15  (2 unrouted)
N$16  (2 unrouted)
N$17  (1 unrouted)
N$18  (2 unrouted)
N$19  (2 unrouted)
N$20  (2 unrouted)
N$21  (2 unrouted)
N$22  (2 unrouted)
N$23  (3 unrouted)
N$24  (1 unrouted)
N$25  (2 unrouted)
N$26  (3 unrouted)
N$27  (1 unrouted)
  Top 0.305: 83.76,49.05 R48.2
N$29  (1 unrouted)
N$30  (3 unrouted)
N$31  (1 unrouted)
N$32  (1 unrouted)
N$33  (1 unrouted)
N$34  (2 unrouted)
N$35  (1 unrouted)
N$36  (1 unrouted)
N$37  (1 unrouted)
N$38  (2 unrouted)
N$39  (2 unrouted)
N$40  (1 unrouted)
N$41  (1 unrouted)
N$42  (1 unrouted)
N$43  (1 unrouted)
N$44  (1 unrouted)
N$45  (1 unrouted)
N$46  (2 unrouted)
N$47  (2 unrouted)
N$48  (2 unrouted)
  Top 0.305: 68.58,40.22 C14.1
N$49  (1 unrouted)
N$50  (2 unrouted)
  Top 0.305: 67.31,38.52 C15.1
N$51  (2 unrouted)
N$52  (2 unrouted)
N$53  (2 unrouted)
N$54  (3 unrouted)
N$55  (1 unrouted)
N$56  (2 unrouted)
N$57  (3 unrouted)
N$58  (3 unrouted)
  Bottom 1.27: L2.2 91.7,10.79 arc-45 92.6,10.42 R57.2
N$59  (1 unrouted)
N$60  (2 unrouted)
N$61  (2 unrouted)
N$63  (2 unrouted)
N$64  (1 unrouted)
N$65  (2 unrouted)
N$66  (2 unrouted)
N$67  (2 unrouted)
N$68  (1 unrouted)
N$69  (2 unrouted)
N$70  (2 unrouted)
N$71  (2 unrouted)
N$72  (2 unrouted)
N$73  (2 unrouted)
N$74  (1 unrouted)
N$75  (4 unrouted)
  Bottom 0.305: U$11.18 22.23,38.58 | 22.23,38.58 22.15,38.66 | U$11.19 22.86,38.1 22.71,38.1 22.23,38.58 | 22.15,38.66 R39.2 | U$11.20 23.37,38.23 22.86,38.73 22.23,38.73 22.15,38.66 | U$11.17 21.46,36.32 20.95,36.83 20.95,38.58 R39.2 | R39.2 21.59,39.37
N$76  (2 unrouted)
N$77
  Bottom 0.305: LTC3411.4 72.89,9.66 73.66,8.89
  Bottom 1.27: L2.1 84.63,10.87 arc-45 84.7,11.04 | 84.7,11.04 85.09,11.43 | 84.7,11.04 82.55,8.89 73.66,8.89
N$78
  Bottom 0.305: U$11.16 20.57,35.81 20.32,35.56 20.57,35.31 | U$11.15 20.57,35.31 | U$11.14 21.08,34.8 20.57,35.31
  Bottom 1.27: L1.2 20.32,35.56
N$79  (2 unrouted)
N$80  (2 unrouted)
RST/SBWTDIO  (1 unrouted)
SC+  (2 unrouted)
  Top 1.27: SC_TOP.2 SC_TOP.1 | R8.1 5.08,71.54 SC_BOT.2 SC_BOT.1
SC-
  Top 1.27: SC_JMPR.2 24.13,71.12 22.86,72.39 22.86,74.93 24.13,76.2 SC_JMPR.4 SC_TOP.4 SC_TOP.3 19.05,77.47 17.78,78.74 11.43,78.74 10.16,77.47 SC_BOT.4 SC_BOT.3
TEST/SBWTCK  (1 unrouted)
THD_DETECT  (1 unrouted)
UUU  (2 unrouted)
V_BT_MS  (2 unrouted)
V_BUS_MS  (2 unrouted)
VCC  (via drill 0.6)  (35 unrouted)
  Top 0.254: IC11.8 78.31,17.15 C_IC11.2 | C_ICU8.2 47.84,26.45 48.26,26.04 U$8.7 | C_IC3.2 10.58,52.49 10.16,52.07 9.61,52.07 IC3.8 | C_IC6.2 33.32,55.46 IC6.8 | C_IC5.2 23.16,55.46 IC5.8 | C_IC4.2 46.14,49.95 45.72,49.53 45.72,48.9 45.17,48.9 IC4.8 | FERRITE_BEAD.1 62.23,40.64 | 64.77,43.18 C21.1 | C_IC7.2 6.77,26.25 6.35,26.67 6.35,27.22 IC7.8 | C_IC9.2 6.77,18.63 6.35,19.05 6.35,19.6 IC9.8 | C_IC2.2 32.6,13.67 IC2.8
  Top 1.27: R8.2 R6.1 15.24,71.12 v12.7,68.58 | v2.54,68.58 2.54,38.1 | 2.54,38.1 v2.54,13.97 2.54,12.68 U$7.2 | v5.08,38.1 2.54,38.1 | v97.79,62.23 97.79,67.33 U$6.2
  Bottom 0.254: C_IC12.2 77.89,17.57 76.63,16.3 IC12.8 | C_IC10.2 IC10.8
  Bottom 1.27: v12.7,68.58 v2.54,68.58 | L1.1 5.89,37.29 v5.08,38.1 | v2.54,13.97 2.54,6.35 7.62,1.27 92.71,1.27 93.98,2.54 R57.1 95.1,6.2 97.79,8.89 v97.79,62.23
VREF  (11 unrouted)